# Altium schematic sheet 0023_DDR5 SODIMM CONTRO.SchDoc
size 848 x 558 mm
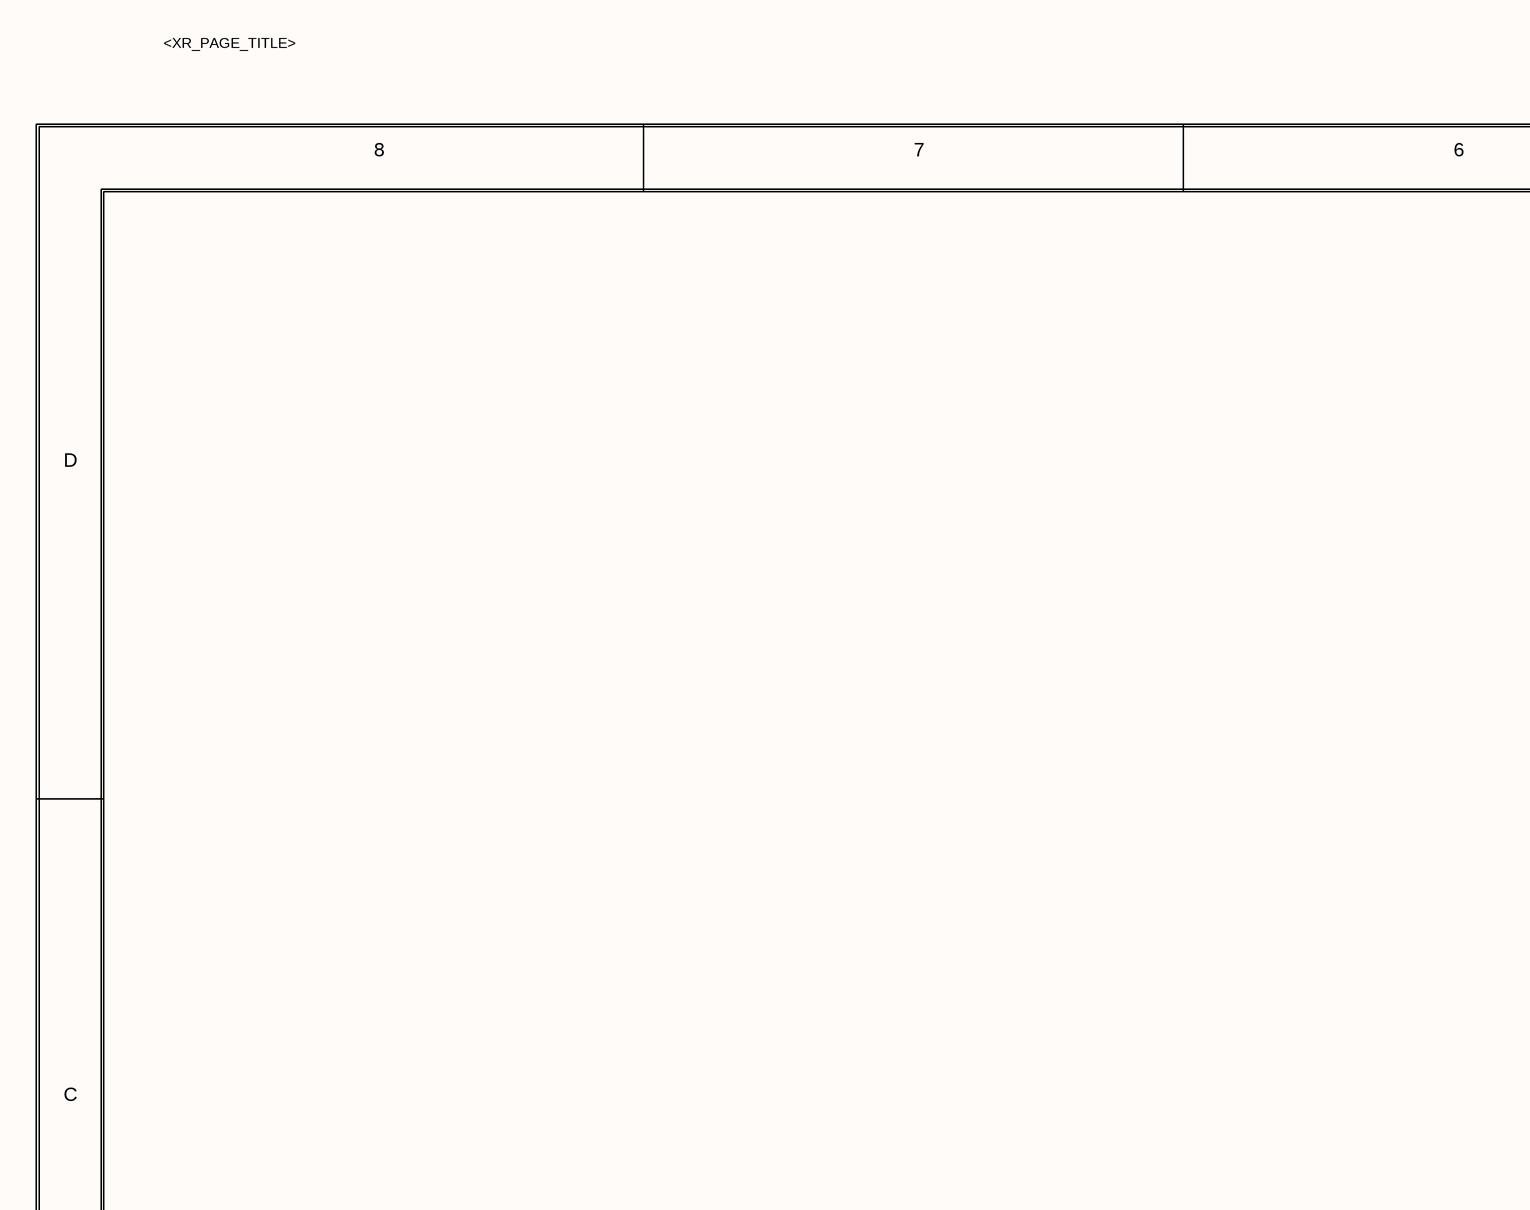
[diagram p0: 0023_DDR5 SODIMM CONTRO.SchDoc, top left]
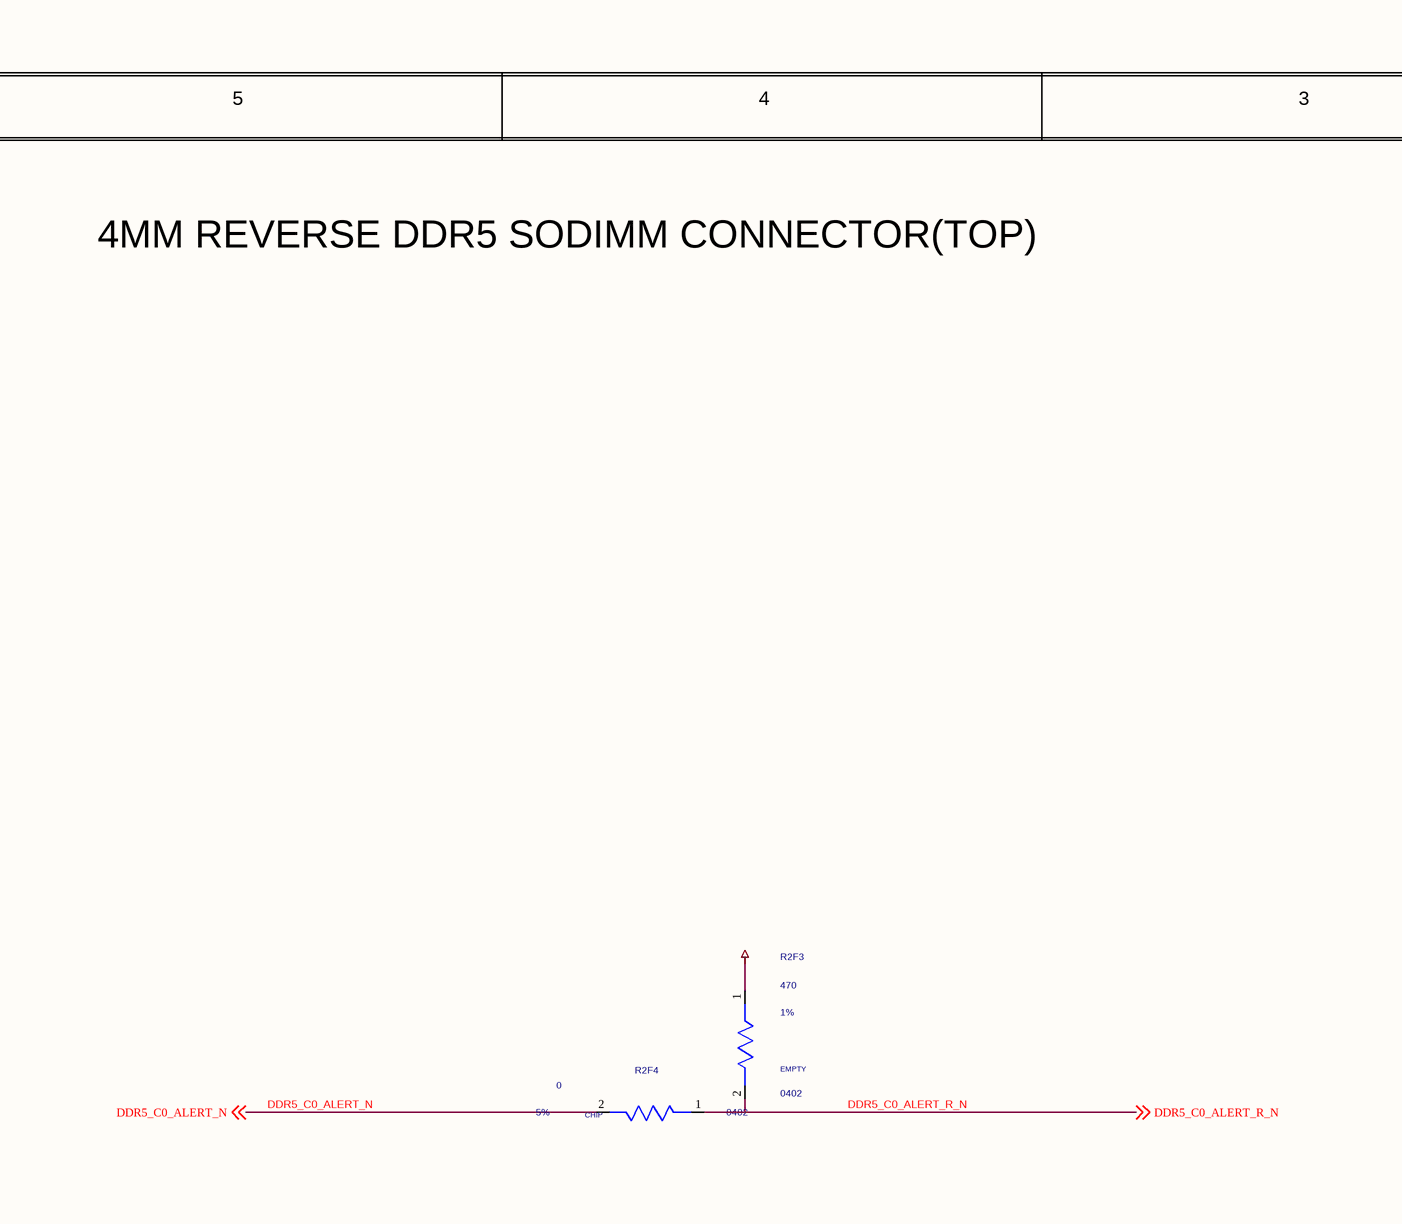
[diagram p1: 0023_DDR5 SODIMM CONTRO.SchDoc, top middle]
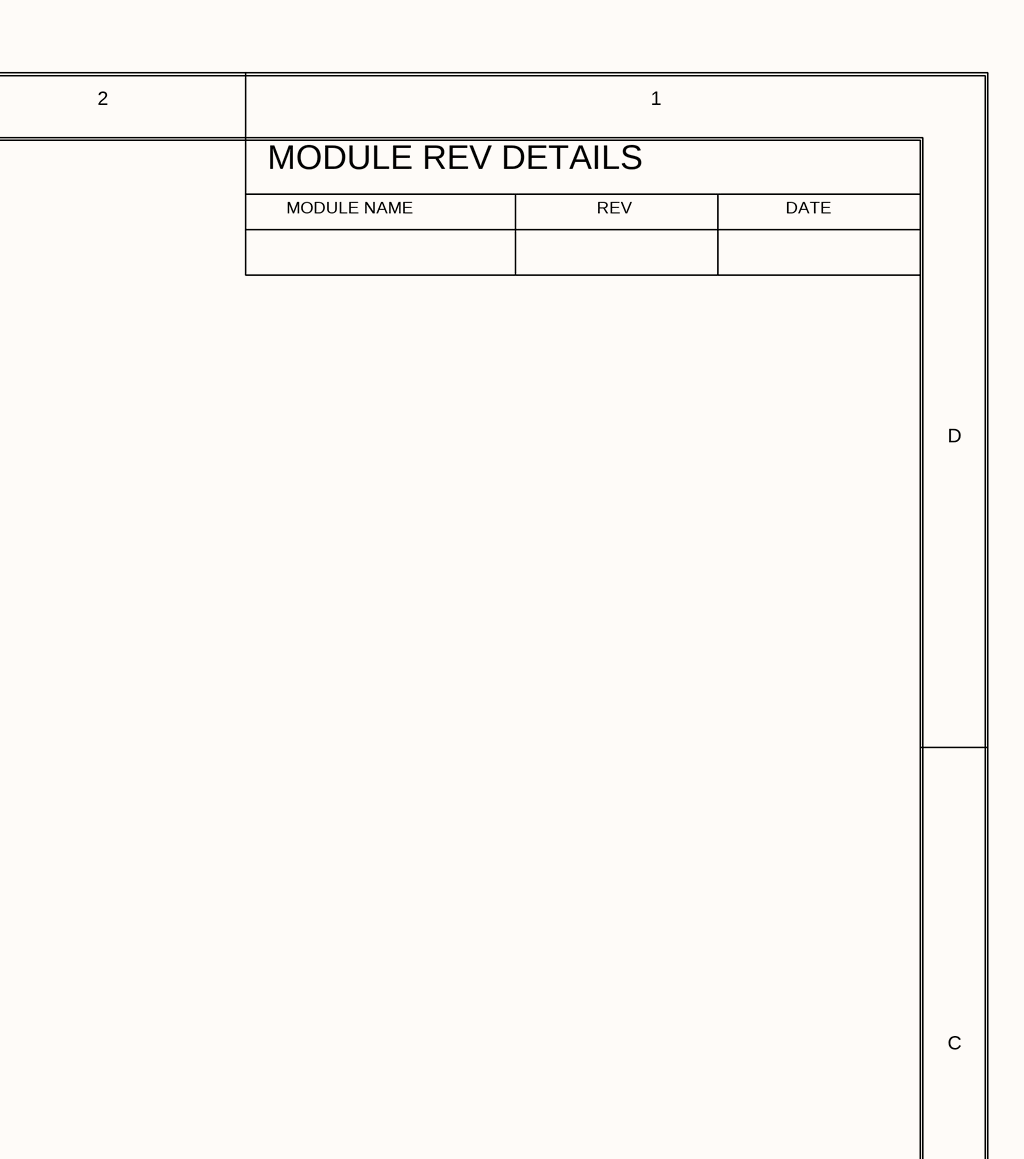
[diagram p2: 0023_DDR5 SODIMM CONTRO.SchDoc, top right]
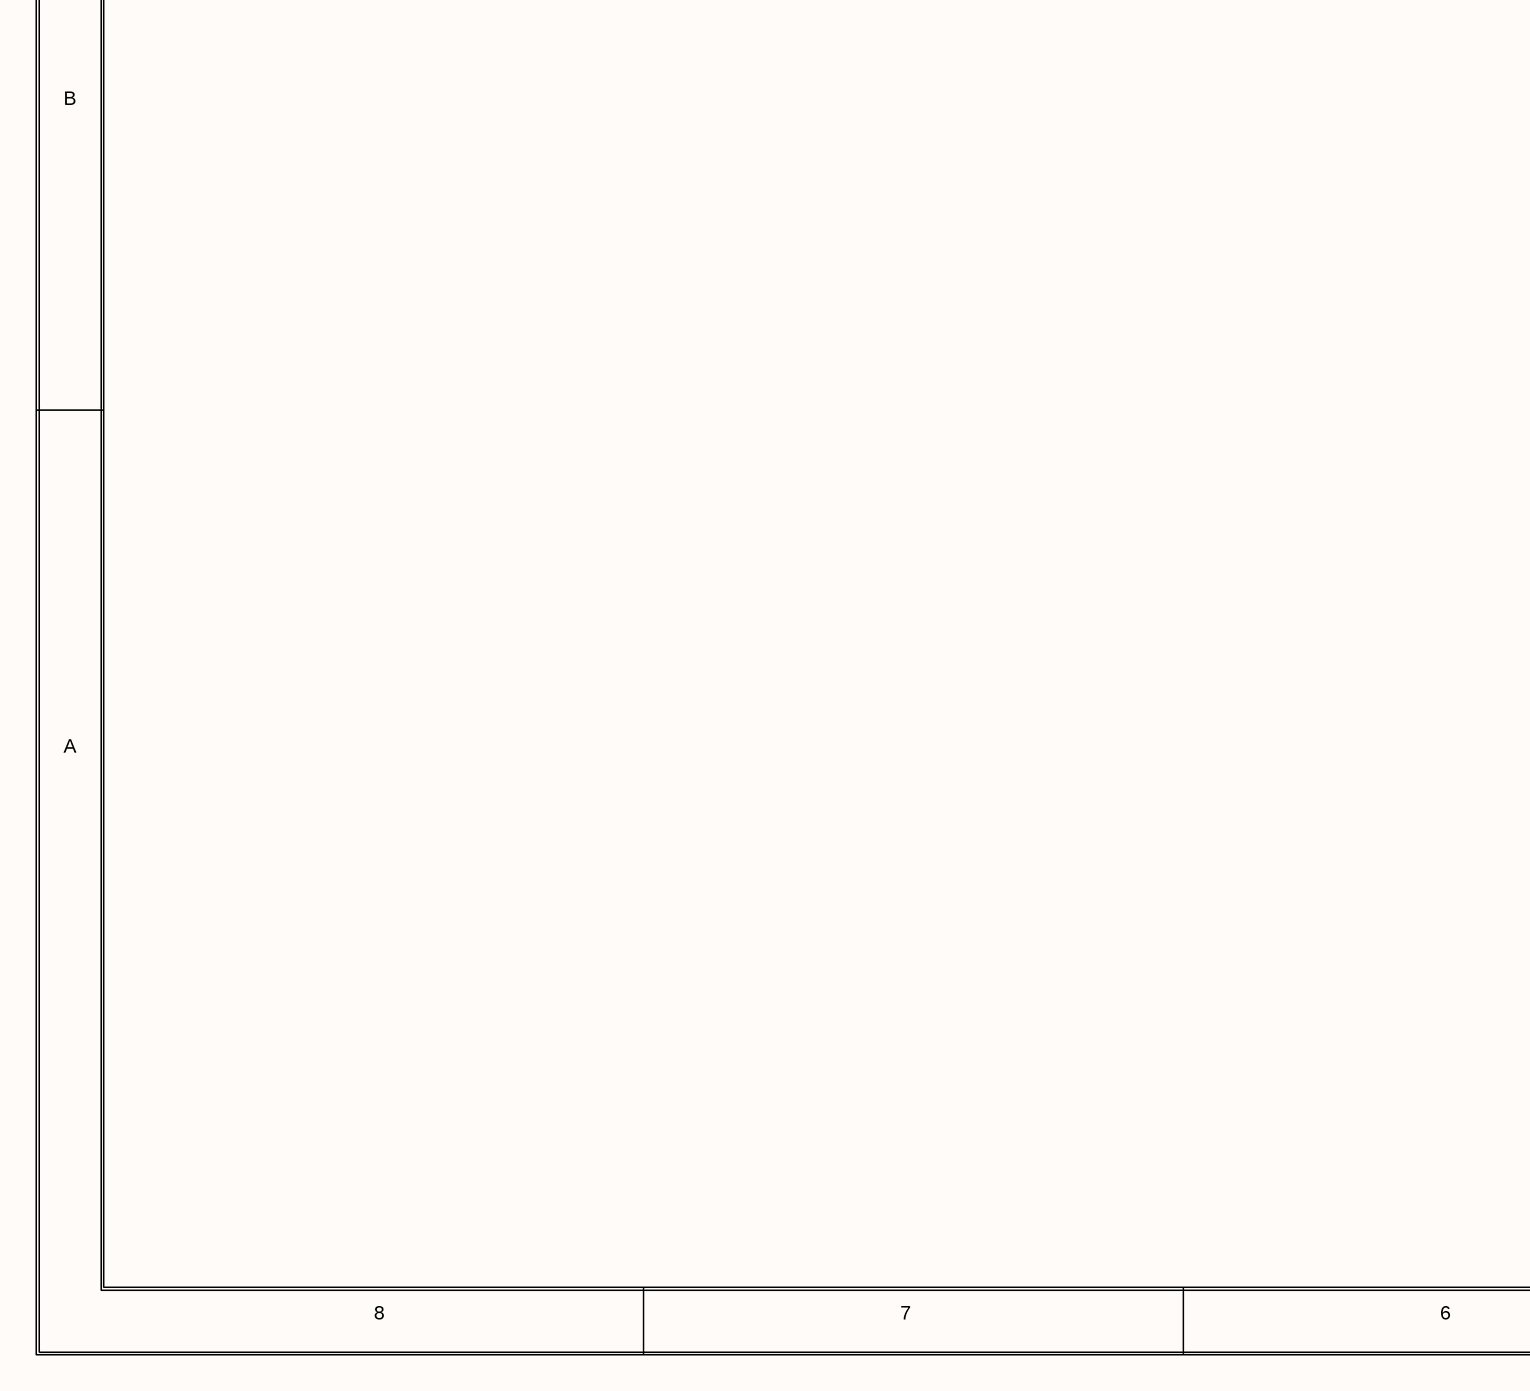
[diagram p3: 0023_DDR5 SODIMM CONTRO.SchDoc, bottom left]
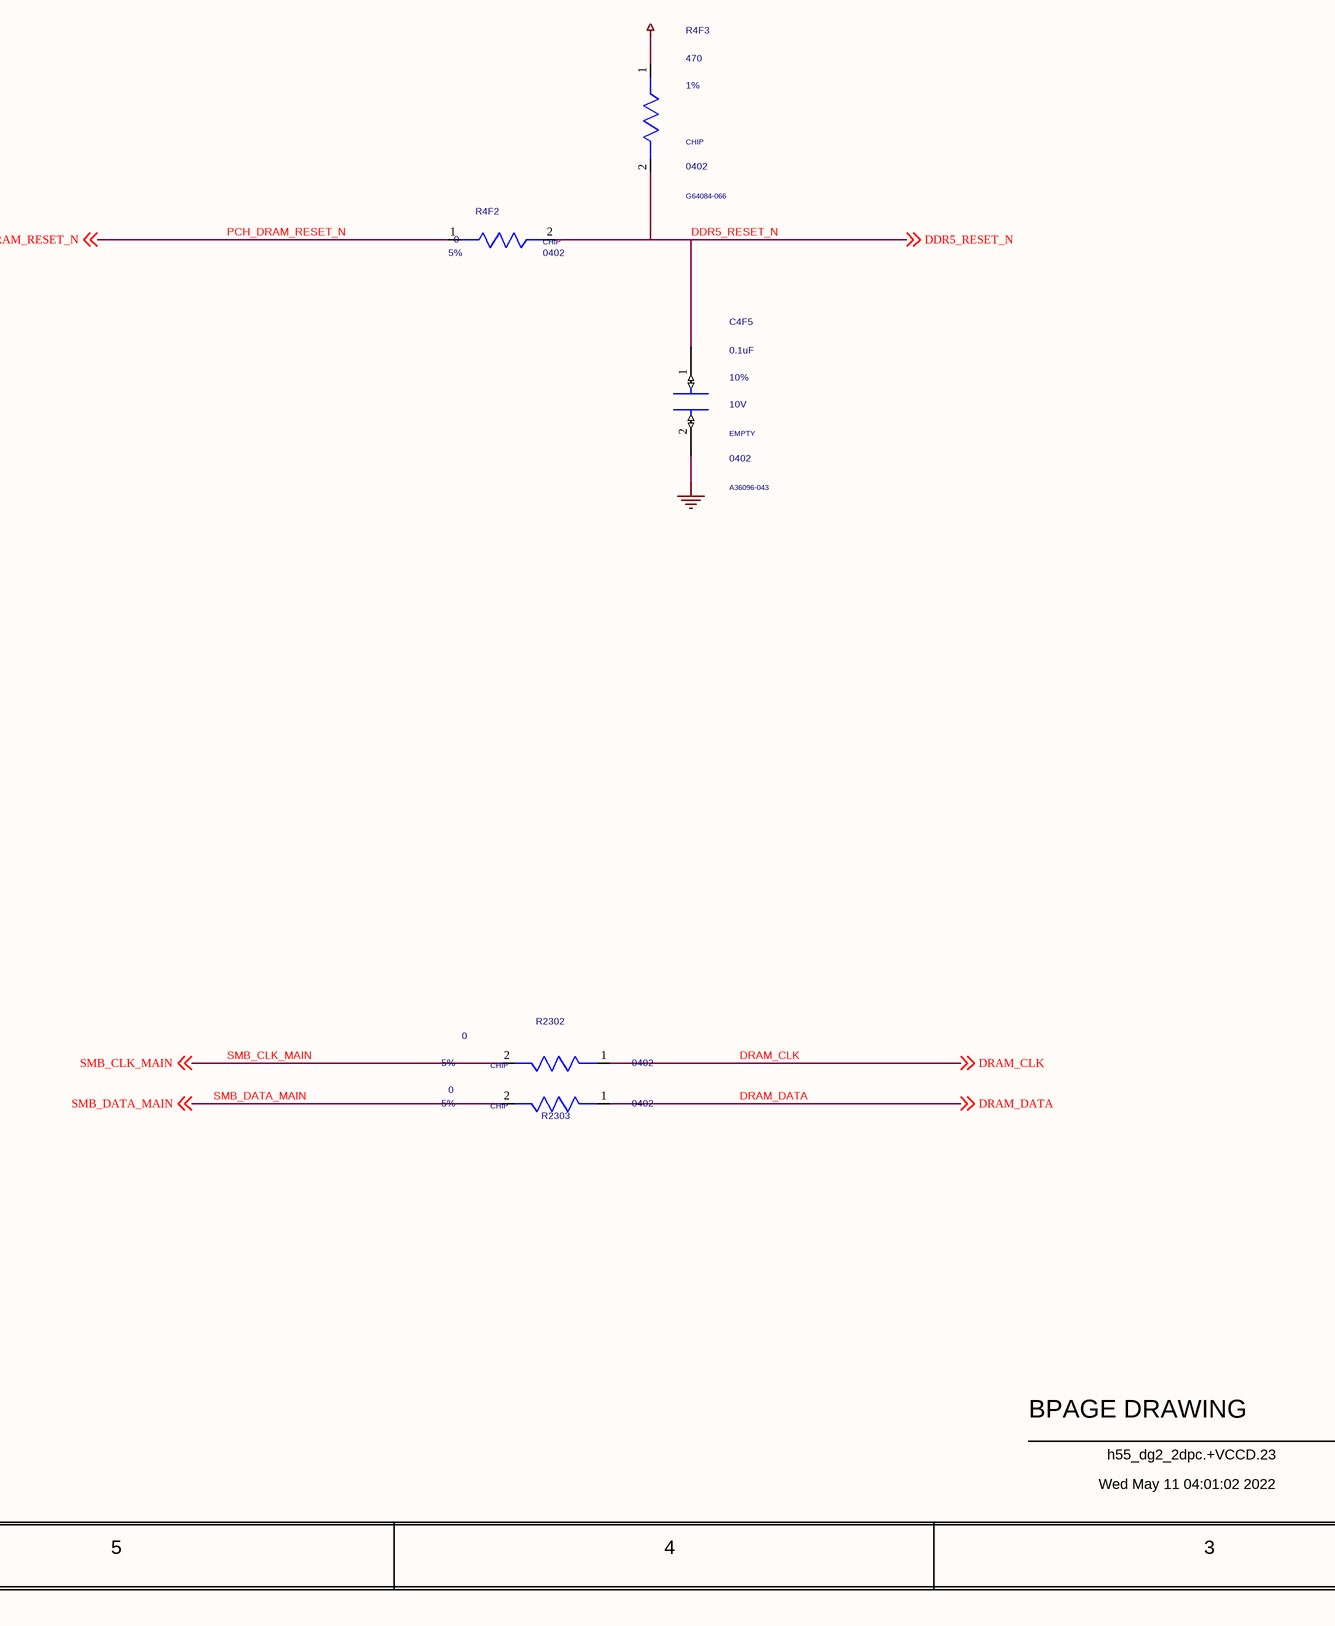
[diagram p4: 0023_DDR5 SODIMM CONTRO.SchDoc, bottom middle]
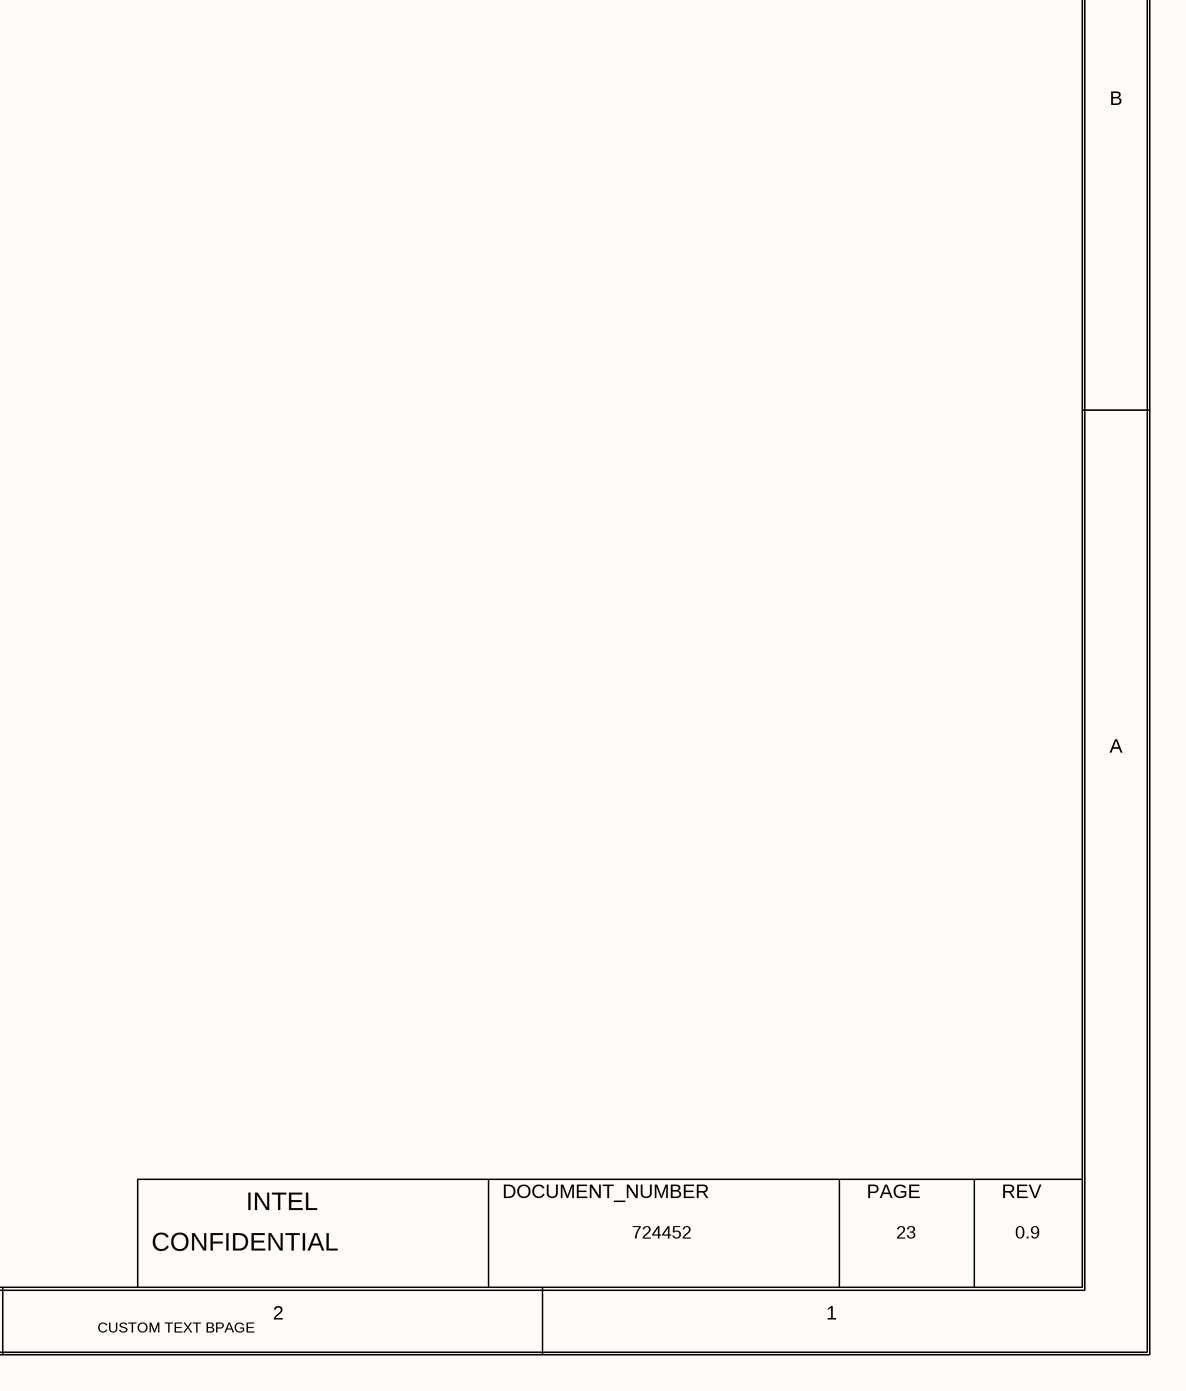
[diagram p5: 0023_DDR5 SODIMM CONTRO.SchDoc, bottom right]

## Parts
C4F5  0.1uF  MATERIAL: EMPTY  PACK_TYPE: 0402  PART_NUMBER: A36096-043  TOLERANCE: 10%  VOLTAGE: 10V  [SMC0402IA]
R2F3  470  MATERIAL: EMPTY  PACK_TYPE: 0402  TOLERANCE: 1%  [SMR0402IA]
R2F4  0  MATERIAL: CHIP  PACK_TYPE: 0402  TOLERANCE: 5%  [SMR0402IA]
R4F2  0  MATERIAL: CHIP  PACK_TYPE: 0402  TOLERANCE: 5%  [SMR0402IA]
R4F3  470  MATERIAL: CHIP  PACK_TYPE: 0402  PART_NUMBER: G64084-066  TOLERANCE: 1%  [SMR0402IA]
R2302  0  MATERIAL: CHIP  PACK_TYPE: 0402  TOLERANCE: 5%  [SMR0402IA]
R2303  0  MATERIAL: CHIP  PACK_TYPE: 0402  TOLERANCE: 5%  [SMR0402IA]

## Nets
+VCCDD2_PROC: R2F3.1(A) R4F3.1(A)
GND: C4F5.2(B)
DDR5_C0_ALERT_N: R2F4.2(B) ; off-sheet DDR5_C0_ALERT_N
DDR5_C0_ALERT_R_N: R2F3.2(B) R2F4.1(A) ; off-sheet DDR5_C0_ALERT_R_N
DDR5_RESET_N: C4F5.1(A) R4F2.2(B) R4F3.2(B) ; off-sheet DDR5_RESET_N
DRAM_CLK: R2302.1(A) ; off-sheet DRAM_CLK
DRAM_DATA: R2303.1(A) ; off-sheet DRAM_DATA
PCH_DRAM_RESET_N: R4F2.1(A) ; off-sheet PCH_DRAM_RESET_N
SMB_CLK_MAIN: R2302.2(B) ; off-sheet SMB_CLK_MAIN
SMB_DATA_MAIN: R2303.2(B) ; off-sheet SMB_DATA_MAIN

## Notes on the sheet
- <XR_PAGE_TITLE>
- 8
- 7
- 6
- 5
- 4
- 3
- 2
- 1
- MODULE REV DETAILS
- 4MM REVERSE DDR5 SODIMM CONNECTOR(TOP)
- MODULE NAME
- REV
- DATE
- D
- C
- B
- A
- BPAGE DRAWING
- INTEL
- DOCUMENT_NUMBER
- PAGE
- Wed May 11 04:01:02 2022
- h55_dg2_2dpc.+VCCD.23
- CONFIDENTIAL
- 724452
- 23
- 0.9
- CUSTOM TEXT BPAGE

## Library data of the parts
C4F5 = CAP: CDS_PHYS_PART_NAME: CAP_0402-A36096-043,EMPTY,0.1UF,10V,10%,LPDB,GENERIC; OriginalSymbolOrigin: (-50,25); XY: (-3725,1725); VER: 1; ROT: 0; PHYS_PAGE: 23; LOCATION: C4F5; IP: GENERIC; FP_TECH: LPDB; DRAWING: @RVP1_ADL_SB_ADP_S_DDR5_SODIMM_2DPC_LIB.H55_DG2_2DPC(SCH_1):PAGE23; CDS_LIB: discrete; PCB Footprint: SMC0402IA; SEC_TYPE: 0402; CHIPS_PART_NAME: CAP; CDS_PART_NAME: CAP_0402-A36096-043,EMPTY,0.1UF,10V,10%,LPDB,GENERIC; CDS_LOCATION: C4F5
R2F3 = RES: PART_NUMBER: G64084-066; CDS_PHYS_PART_NAME: RES_0402-G64084-066,EMPTY,470,1%,1/16W,LPDB,GENERIC; WATTAGE: 1/16W; OriginalSymbolOrigin: (-25,75); XY: (-3825,2975); VER: 2; ROT: 0; PHYS_PAGE: 23; LOCATION: R2F3; IP: GENERIC; FP_TECH: LPDB; DRAWING: @RVP1_ADL_SB_ADP_S_DDR5_SODIMM_2DPC_LIB.H55_DG2_2DPC(SCH_1):PAGE23; CDS_LIB: discrete; PCB Footprint: SMR0402IA; CHIPS_PART_NAME: RES; CDS_PART_NAME: RES_0402-G64084-066,EMPTY,470,1%,1/16W,LPDB,GENERIC; CDS_LOCATION: R2F3
R2F4 = RES#1: PART_NUMBER: A93549-001; CHIPS_PART_NAME: RES; CDS_PHYS_PART_NAME: RES_0402-A93549-001,CHIP,0,5%,1/16W,LPDB,GENERIC; WATTAGE: 1/16W; OriginalSymbolOrigin: (-75,25); XY: (-4000,2850); VER: 1; ROT: 2; PHYS_PAGE: 23; LOCATION: R2F4; IP: GENERIC; FP_TECH: LPDB; DRAWING: @RVP1_ADL_SB_ADP_S_DDR5_SODIMM_2DPC_LIB.H55_DG2_2DPC(SCH_1):PAGE23; CDS_LIB: discrete; PCB Footprint: SMR0402IA; CDS_PART_NAME: RES_0402-A93549-001,CHIP,0,5%,1/16W,LPDB,GENERIC; CDS_LOCATION: R2F4
R4F2 = RES#1: PART_NUMBER: A93549-001; CHIPS_PART_NAME: RES; CDS_PHYS_PART_NAME: RES_0402-A93549-001,CHIP,0,5%,1/16W,LPDB,GENERIC; WATTAGE: 1/16W; OriginalSymbolOrigin: (-75,25); XY: (-4075,2025); VER: 1; PHYS_PAGE: 23; LOCATION: R4F2; IP: GENERIC; FP_TECH: LPDB; DRAWING: @RVP1_ADL_SB_ADP_S_DDR5_SODIMM_2DPC_LIB.H55_DG2_2DPC(SCH_1):PAGE23; CDS_LIB: discrete; PCB Footprint: SMR0402IA; ROT: 0; CDS_PART_NAME: RES_0402-A93549-001,CHIP,0,5%,1/16W,LPDB,GENERIC; CDS_LOCATION: R4F2; ASI_MODEL: A93549-001
R4F3 = RES: CDS_PHYS_PART_NAME: RES_0402-G64084-066,CHIP,470,1%,1/16W,LPDB,GENERIC; WATTAGE: 1/16W; OriginalSymbolOrigin: (-25,75); XY: (-3800,2250); VER: 2; ROT: 0; PHYS_PAGE: 23; LOCATION: R4F3; IP: GENERIC; FP_TECH: LPDB; DRAWING: @RVP1_ADL_SB_ADP_S_DDR5_SODIMM_2DPC_LIB.H55_DG2_2DPC(SCH_1):PAGE23; CDS_LIB: discrete; PCB Footprint: SMR0402IA; SEC_TYPE: 0402; CHIPS_PART_NAME: RES; CDS_PART_NAME: RES_0402-G64084-066,CHIP,470,1%,1/16W,LPDB,GENERIC; CDS_LOCATION: R4F3
R2302 = RES#1: PART_NUMBER: A93549-001; CHIPS_PART_NAME: RES; CDS_PHYS_PART_NAME: RES_0402-A93549-001,CHIP,0,5%,1/16W,LPDB,GENERIC; WATTAGE: 1/16W; OriginalSymbolOrigin: (-75,25); XY: (-3975,500); VER: 1; ROT: 2; PHYS_PAGE: 23; LOCATION: R2302; IP: GENERIC; FP_TECH: LPDB; DRAWING: @RVP1_ADL_SB_ADP_S_DDR5_SODIMM_2DPC_LIB.H55_DG2_2DPC(SCH_1):PAGE23; CDS_LIB: discrete; PCB Footprint: SMR0402IA; CDS_PART_NAME: RES_0402-A93549-001,CHIP,0,5%,1/16W,LPDB,GENERIC; CDS_LOCATION: R2302
R2303 = RES#1: PART_NUMBER: A93549-001; CHIPS_PART_NAME: RES; CDS_PHYS_PART_NAME: RES_0402-A93549-001,CHIP,0,5%,1/16W,LPDB,GENERIC; WATTAGE: 1/16W; OriginalSymbolOrigin: (-75,25); XY: (-3975,425); VER: 1; ROT: 2; PHYS_PAGE: 23; LOCATION: R2303; IP: GENERIC; FP_TECH: LPDB; DRAWING: @RVP1_ADL_SB_ADP_S_DDR5_SODIMM_2DPC_LIB.H55_DG2_2DPC(SCH_1):PAGE23; CDS_LIB: discrete; PCB Footprint: SMR0402IA; CDS_PART_NAME: RES_0402-A93549-001,CHIP,0,5%,1/16W,LPDB,GENERIC; CDS_LOCATION: R2303